# EasyEDA schematic 7 SEGMENT SCHEMATIC.json
TITLE: Sheet_1; REV: 1.0; Date: 2024-04-04; Sheet: 1/1; Drawn By: ab2397; Company: Your Company
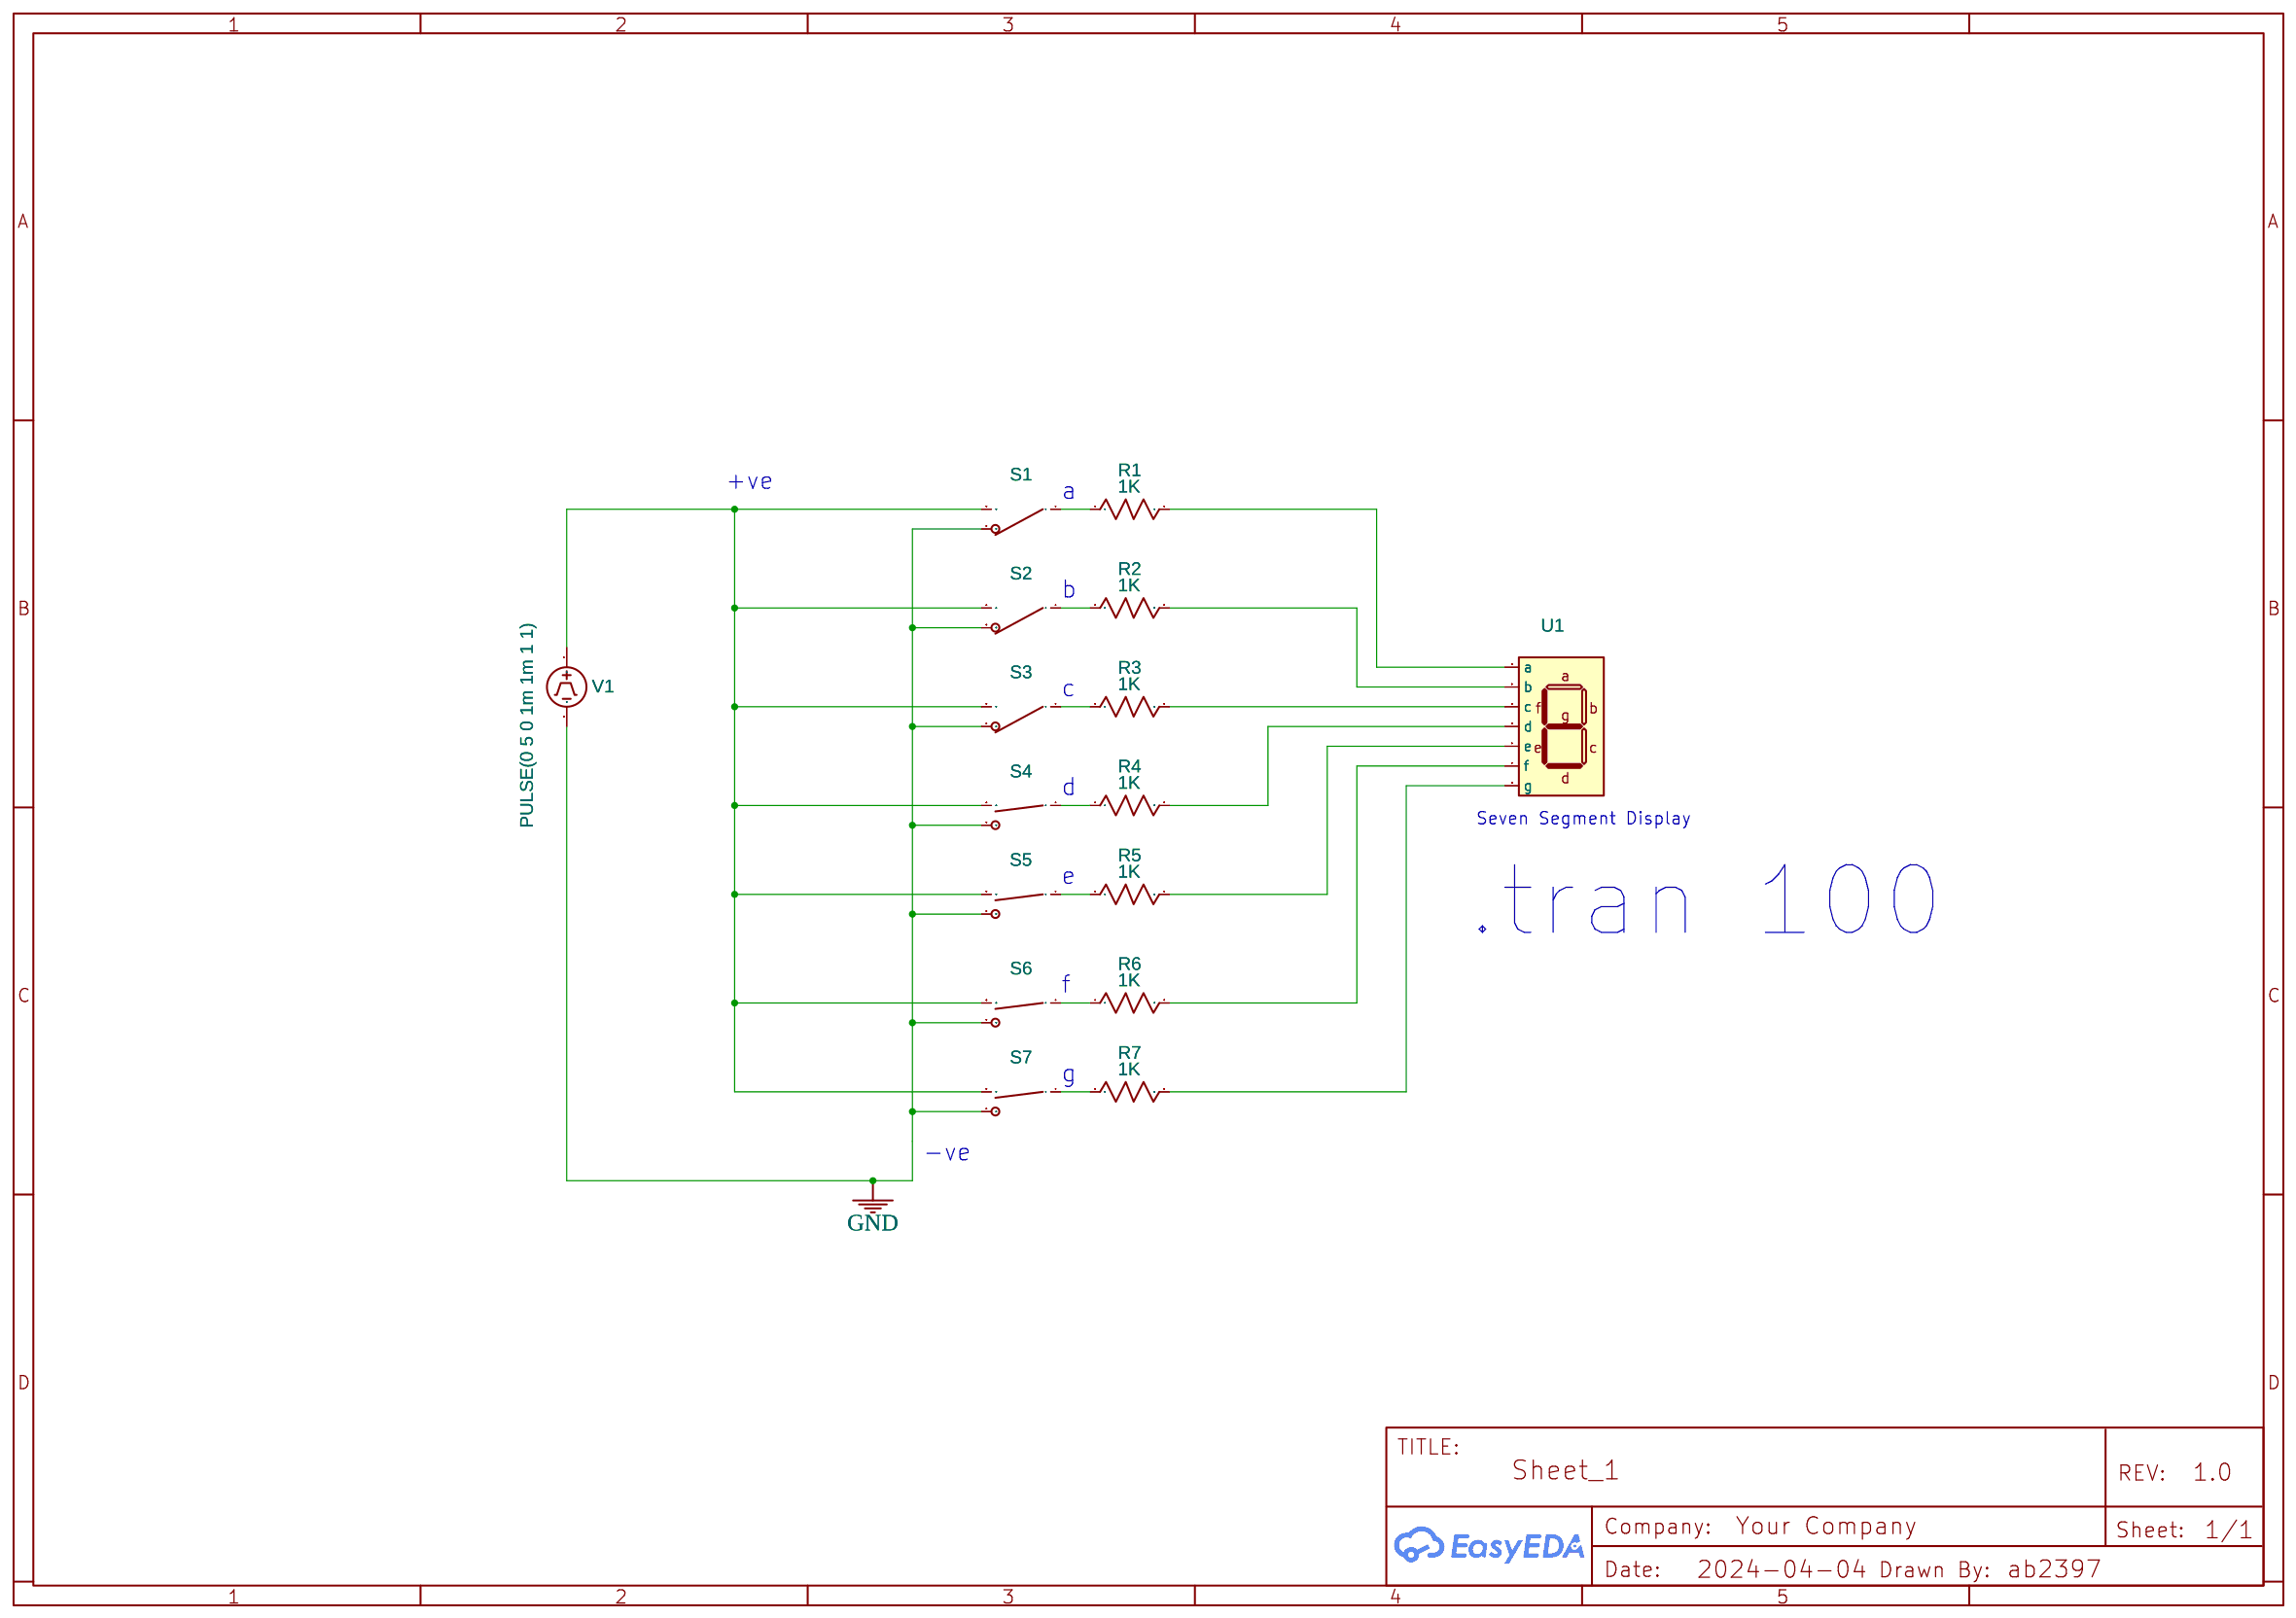
[diagram p0: schematic sheet]

## Parts
R1  1K  [AXIAL-0.3]
R2  1K  [AXIAL-0.3]
R3  1K  [AXIAL-0.3]
R4  1K  [AXIAL-0.3]
R5  1K  [AXIAL-0.3]
R6  1K  [AXIAL-0.3]
R7  1K  [AXIAL-0.3]
S1  SPDT_Open
S2  SPDT_Open
S3  SPDT_Open
S4  SPDT_Open
S5  SPDT_Open
S6  SPDT_Open
S7  SPDT_Open
U1  Seven_Segment
V1  PULSE(0 5 0 1m 1m 1 1)  [HDR1X2]

## Library data of the parts
R1-R7 = Resistor_US: Resistance: 1k; Contributor: EasyEDA; Supplier: YUJING
S1-S3 = SPDT: catid: 20; Contributor: EasyEDA; State: Open; NameDisplay: 0
S4-S7 = SPDT: catid: 20; Contributor: EasyEDA; State: Close; NameDisplay: 0
U1 = SEVENSEGMENT: catid: 20; Type: Common Anode; Color: Red; Contributor: EasyEDA; NameDisplay: 0
V1 = VPULSE: Contributor: EasyEDA; sim: true

## Nets
GND: S1.2 S2.2 S3.2 S4.2 S5.2 S6.2 S7.2 V1.2
Net-(R1-1): R1.1 S1.1
Net-(R1-2): R1.2 U1.a
Net-(R2-1): R2.1 S2.1
Net-(R2-2): R2.2 U1.b
Net-(R3-1): R3.1 S3.1
Net-(R3-2): R3.2 U1.c
Net-(R4-1): R4.1 S4.1
Net-(R4-2): R4.2 U1.d
Net-(R5-1): R5.1 S5.1
Net-(R5-2): R5.2 U1.e
Net-(R6-1): R6.1 S6.1
Net-(R6-2): R6.2 U1.f
Net-(R7-1): R7.1 S7.1
Net-(R7-2): R7.2 U1.g
Net-(S1-3): S1.3 S2.3 S3.3 S4.3 S5.3 S6.3 S7.3 V1.1

## Notes on the sheet
- +ve
- a
- b
- c
- d
- Seven Segment Display
- .tran 100
- e
- f
- g
- -ve
